# EasyEDA Pro project pcb.epro, board PCB1
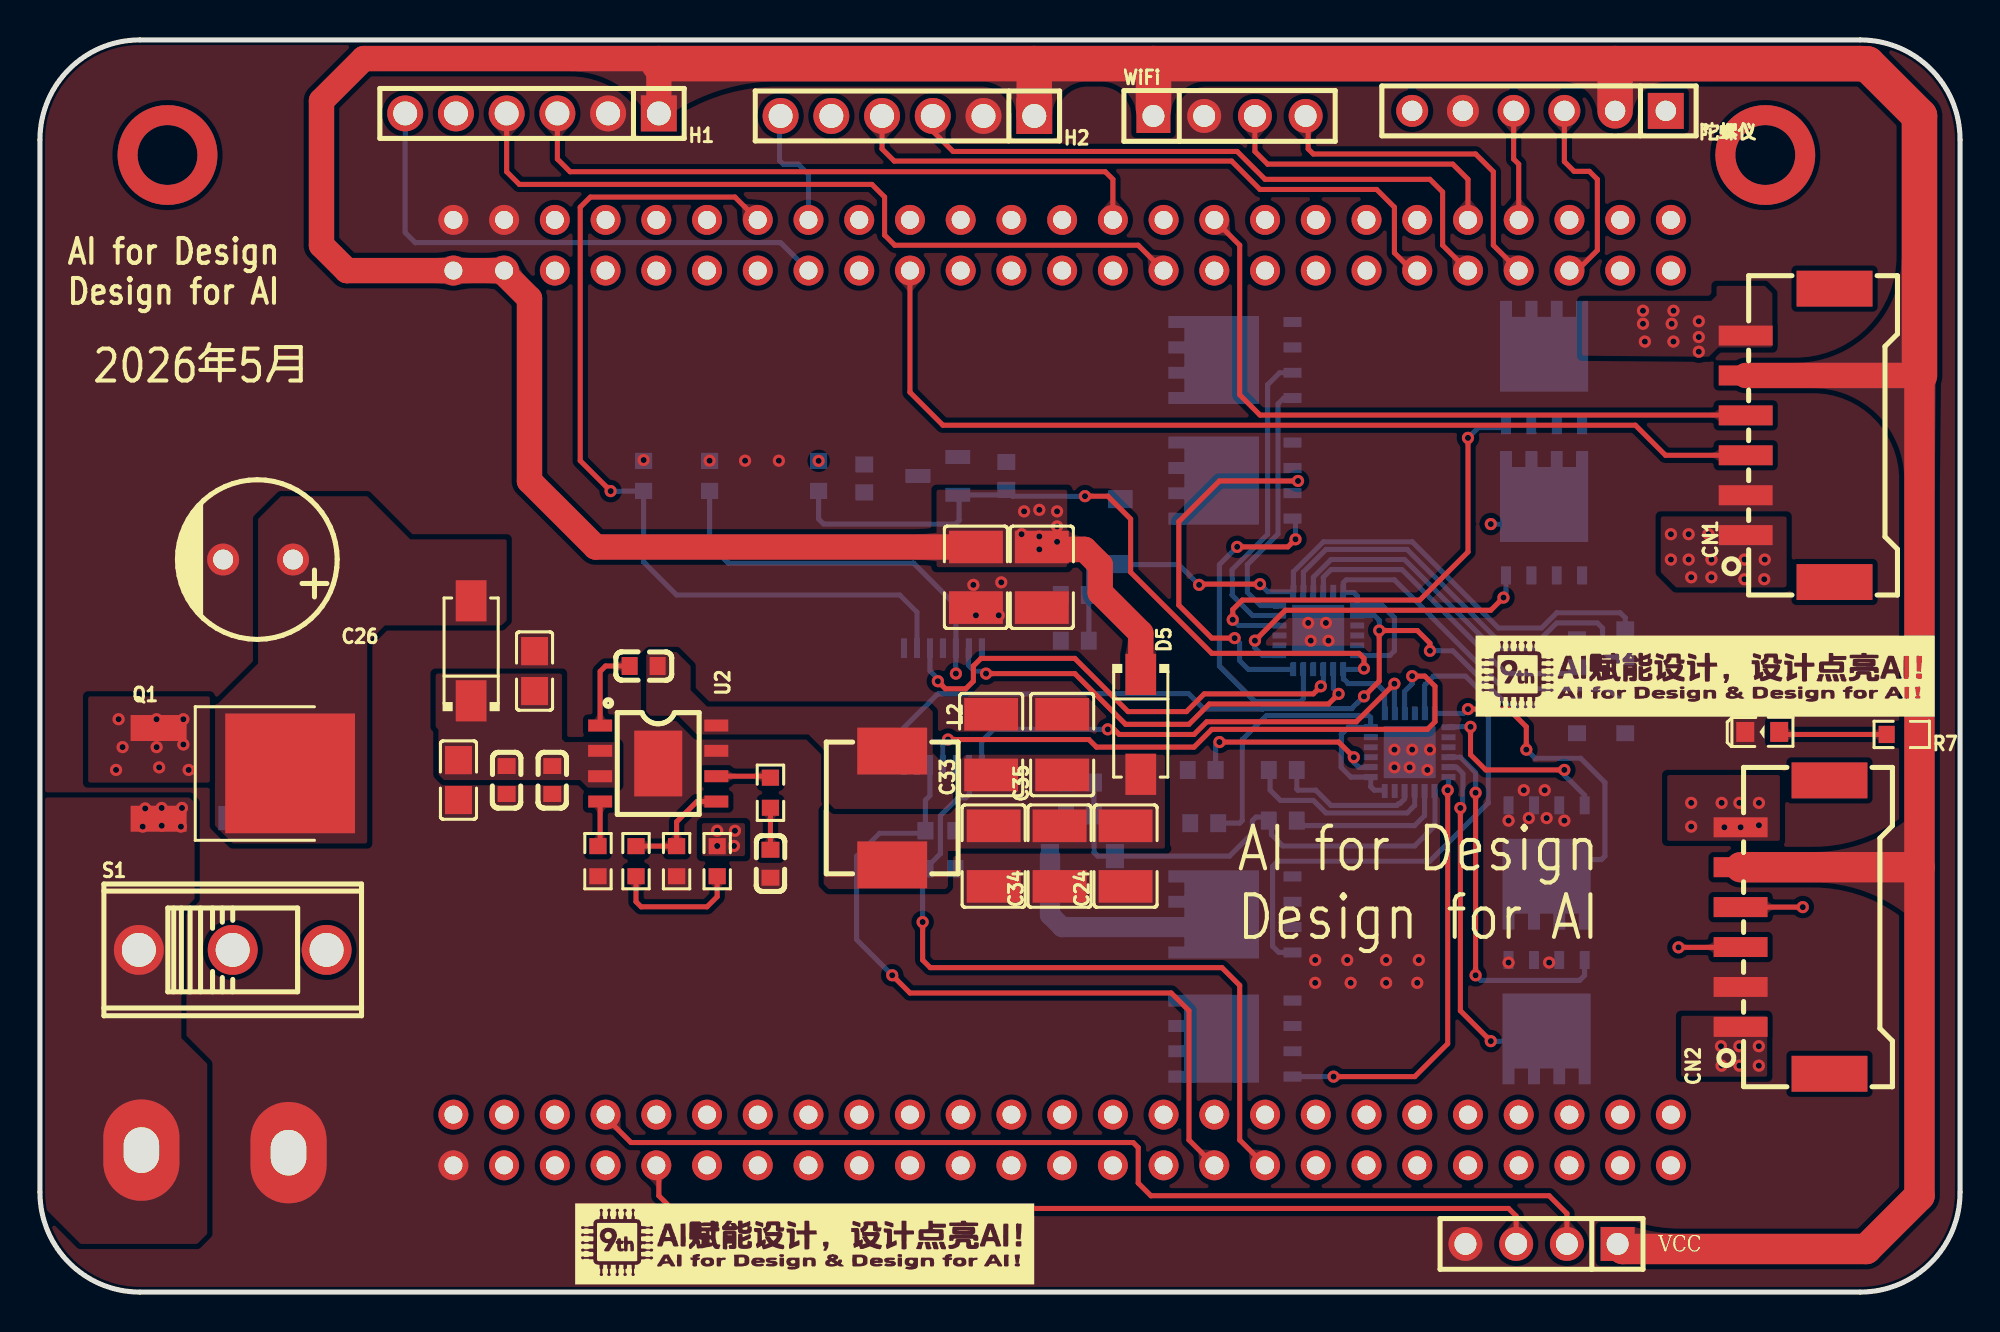
[diagram p1: board, top side]
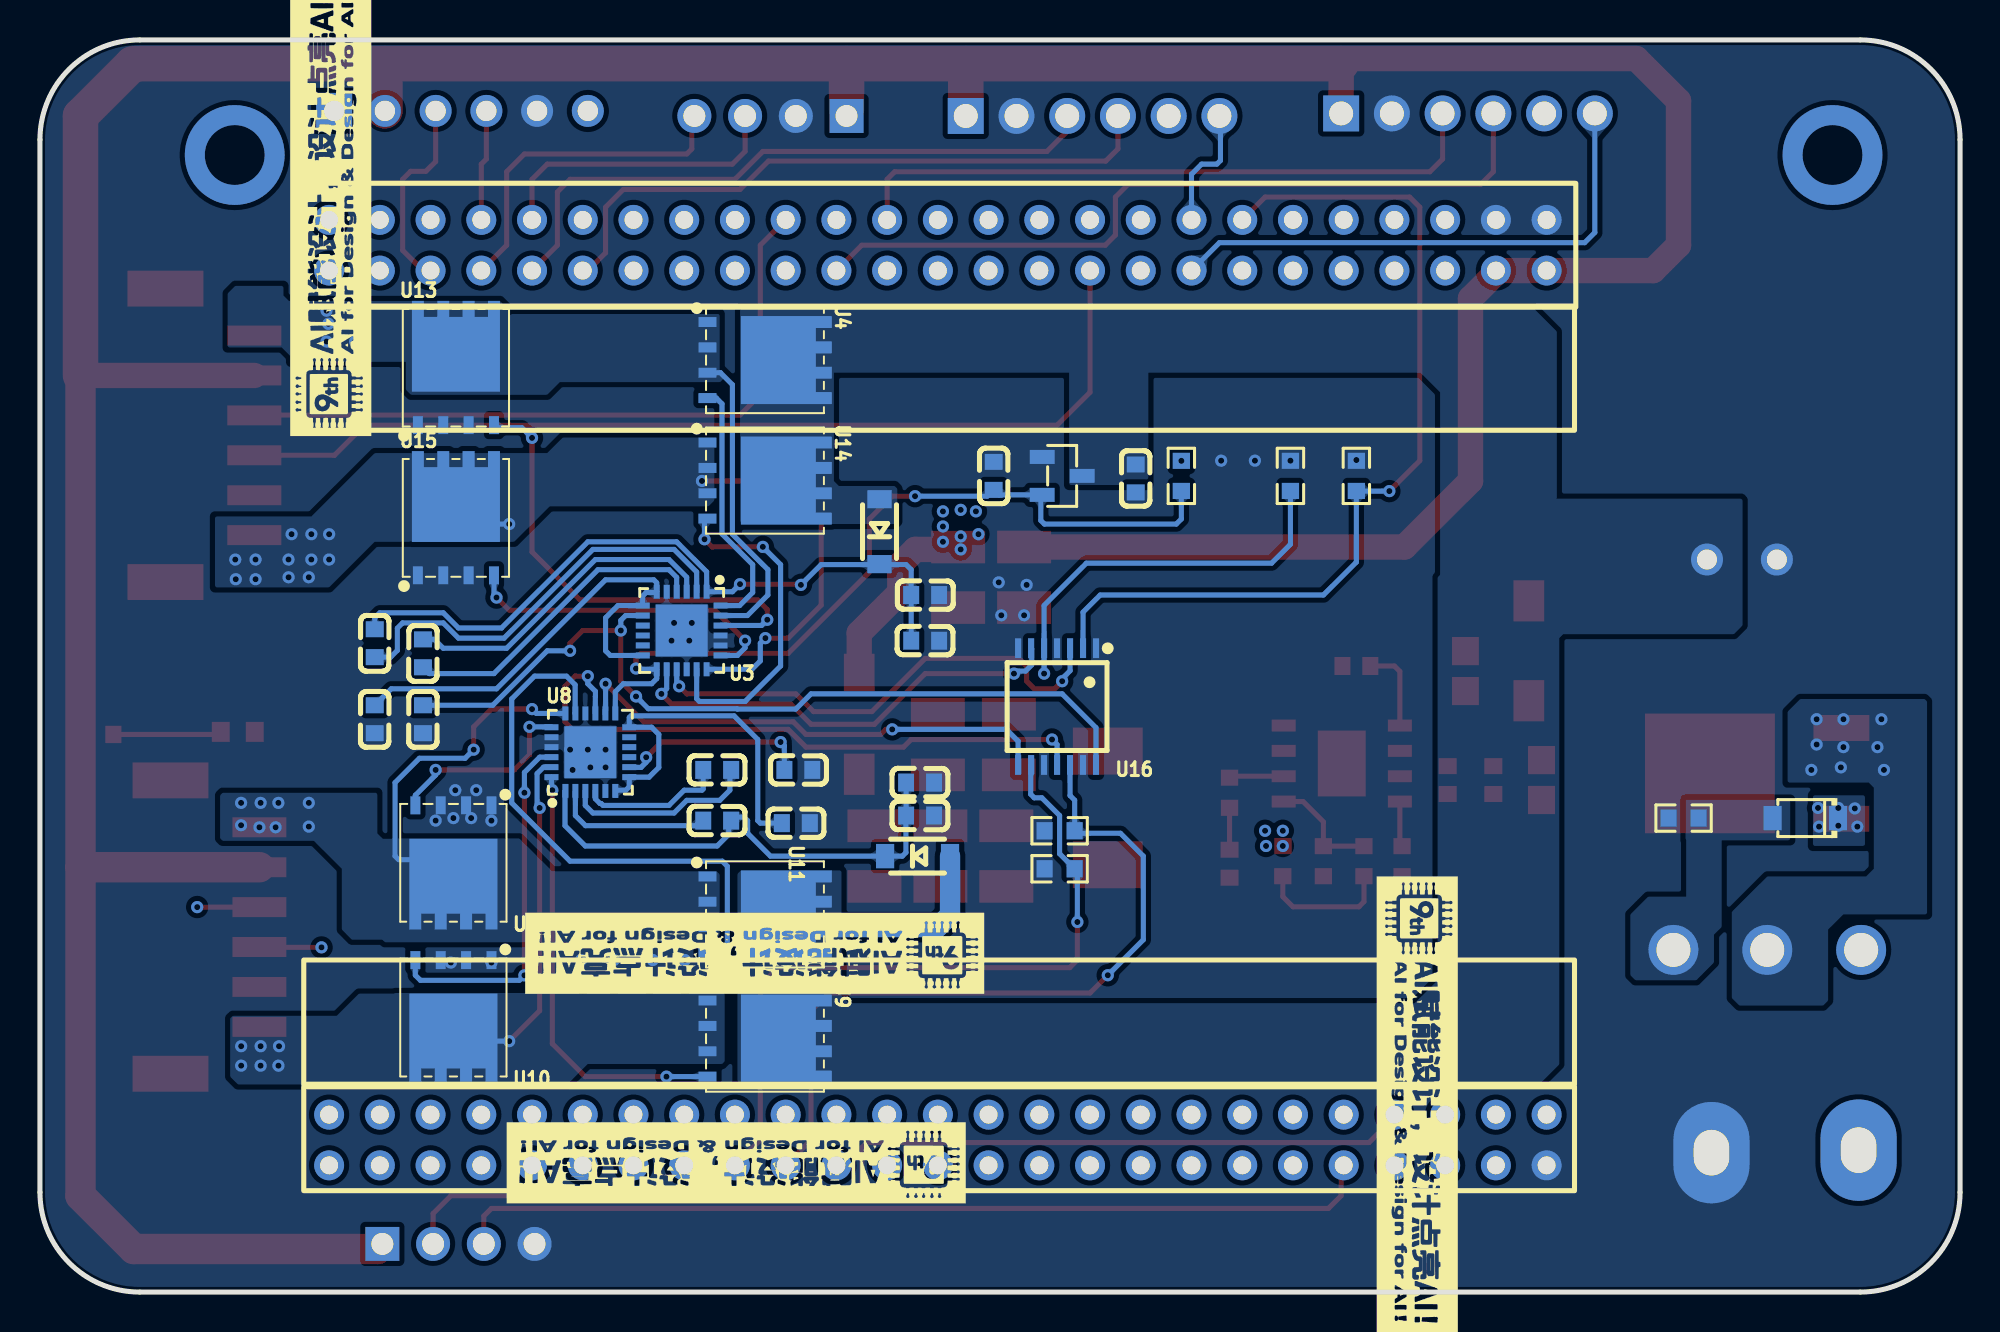
[diagram p2: board, bottom side, seen from below]

Outline 96.14 x 62.74 mm; copper layers: Top Layer, Inner1, Inner2, Bottom Layer. Coordinates in mm from the lower left corner of the outline.
Outline path: 0,57.74 0,5 arc(1.46,1.46) 5,0 91.14,0 arc(94.67,1.46) 96.14,5 96.14,57.74 arc(94.67,61.27) 91.14,62.74 5,62.74 arc(1.46,61.27) 0,57.74
Stack: Top Layer 0.035mm Outer layer thickness 1oz / Dielectric1 0.2104mm 7628 RC49% 8.6mil / Inner1 0.0152mm Inner layer thickness / Dielectric2 1.065mm 1.1mm H/HOZ Copper / Inner2 0.0152mm Inner layer thickness / Dielectric3 0.2104mm 7628 RC49% 8.6mil / Bottom Layer 0.035mm Outer layer thickness 1oz

## Design rules (mm)
spacing copperThickness1oz (default): track to track 0.102, other pairs 0.152 to 0.3
spacing copperThickness2oz: track to track 0.203, other pairs 0.152 to 0.3
spacing Plane_innerPlane: track to track 0.102, other pairs 0.152 to 0.3
spacing Copper_copperRegion: track to track 0.102, other pairs 0.152 to 0.3
spacing Copper_copperRegion_copperThickness1oz: track to track 0.102, other pairs 0.152 to 0.3
spacing Copper_copperRegion_Copper_copperRegion: track to track 0.102, other pairs 0.152 to 0.3
track width copperThickness1oz (default): min 0.127, default 0.254, max 2.54
track width copperThickness2oz: min 0.203, default 0.254, max 2.54
differential pair differentialPair (default): width min 0.127, default 0.254, max 2.54; gap min 0.152, default 0.152
net VCCBAT uses copperRegion_copperThickness1oz
net GND uses copperRegion_copperThickness1oz
net VCC5V uses copperRegion_copperThickness1oz
net $2N36 uses copperRegion_copperThickness1oz
net $2N34 uses copperRegion_copperThickness1oz
net $2N35 uses copperRegion_copperThickness1oz
net L_A uses copperRegion_copperThickness1oz
net L_B uses copperRegion_copperThickness1oz
net R_A uses copperRegion_copperThickness1oz
net R_B uses copperRegion_copperThickness1oz
net $2N77 uses copperRegion_copperThickness1oz
net $2N70 uses copperRegion_copperThickness1oz
net $2N78 uses copperRegion_copperThickness1oz
pour e1000 uses Copper_copperRegion, copperRegion_Copper_copperRegion
pour e1002 uses Copper_copperRegion, copperRegion_Copper_copperRegion
pour e1004 uses Copper_copperRegion, copperRegion_Copper_copperRegion
pour e1006 uses Copper_copperRegion, copperRegion_Copper_copperRegion
pour e1008 uses Copper_copperRegion, copperRegion_Copper_copperRegion
pour e1010 uses Copper_copperRegion, copperRegion_Copper_copperRegion
pour e1012 uses Copper_copperRegion, copperRegion_Copper_copperRegion
pour e1014 uses Copper_copperRegion, copperRegion_Copper_copperRegion
pour e1016 uses Copper_copperRegion, copperRegion_Copper_copperRegion
pour e1018 uses Copper_copperRegion, copperRegion_Copper_copperRegion
pour e1020 uses Copper_copperRegion, copperRegion_Copper_copperRegion
pour e1022 uses Copper_copperRegion, copperRegion_Copper_copperRegion
pour e1024 uses Copper_copperRegion, copperRegion_Copper_copperRegion
pour e1026 uses Copper_copperRegion, copperRegion_Copper_copperRegion
pour e1028 uses Copper_copperRegion, copperRegion_Copper_copperRegion
pour e1030 uses Copper_copperRegion, copperRegion_Copper_copperRegion
pour e1032 uses Copper_copperRegion, copperRegion_Copper_copperRegion
pour e1034 uses Copper_copperRegion, copperRegion_Copper_copperRegion
pour e1036 uses Copper_copperRegion, copperRegion_Copper_copperRegion
pour e1038 uses Copper_copperRegion, copperRegion_Copper_copperRegion
pour e1040 uses Copper_copperRegion, copperRegion_Copper_copperRegion
pour e1042 uses Copper_copperRegion, copperRegion_Copper_copperRegion
pour e1044 uses Copper_copperRegion, copperRegion_Copper_copperRegion
pour e1046 uses Copper_copperRegion, copperRegion_Copper_copperRegion
pour e1048 uses Copper_copperRegion, copperRegion_Copper_copperRegion
pour e1050 uses Copper_copperRegion, copperRegion_Copper_copperRegion
pour e1052 uses Copper_copperRegion, copperRegion_Copper_copperRegion
pour e1054 uses Copper_copperRegion, copperRegion_Copper_copperRegion
pour e1056 uses Copper_copperRegion, copperRegion_Copper_copperRegion
pour e1058 uses Copper_copperRegion, copperRegion_Copper_copperRegion
pour e1063 uses Copper_copperRegion, copperRegion_Copper_copperRegion
pour e1065 uses Copper_copperRegion, copperRegion_Copper_copperRegion
pour e1067 uses Copper_copperRegion, copperRegion_Copper_copperRegion

## Placement (name value [footprint] x y rotation side)
5V  15-21VGC/TR8  [LED0603_GREEN]  86.23 28.07 180 top
C1  1uF  [C1210]  50.17 35.81 270 top
C2  10uF  [C1210]  46.86 35.81 270 top
C3  4.7uF  [C0805]  20.95 25.65 90 top
C4  1uF  [C0603]  79.38 32.51 90 bottom
C5  10uF  [C0603]  51.82 32.64 180 bottom
C6  100nF  [C0603]  51.82 34.93 0 bottom
C7  1uF  [C0603]  58.17 26.16 0 bottom
C8  4.7uF  [C0805]  24.77 31.12 270 top
C12  100nF  [C0603]  52.07 25.53 180 bottom
C13  1uF  [C0603]  76.96 28.7 90 bottom
C14  1uF  [C0603]  79.38 28.7 90 bottom
C15  100nF  [C0603]  76.96 32 90 bottom
C16  1uF  [C0603]  58.29 23.5 0 bottom
C17  100nF  [C0603]  62.23 26.16 180 bottom
C18  1uF  [C0603]  62.23 23.62 180 bottom
C19  10uF  [C0603]  52.07 23.88 180 bottom
C23  47uF  [C1210]  51.18 27.43 90 top
C24  47uF  [C1210]  54.36 21.84 90 top
C25  100nF  [C0603]  30.23 31.37 180 top
C26  470uF  [CAP-TH_BD8.0-P3.50-D0.6-FD_1]  10.92 36.7 180 top
C30  4.7uF  [C0603]  23.37 25.65 90 top
C31  4.7nF  [C0603]  36.58 21.46 270 top
C32  100nF  [C0603]  25.65 25.65 90 top
C33  47uF  [C1210]  47.63 27.43 90 top
C34  47uF  [C1210]  51.05 21.84 90 top
C35  47uF  [C1210]  47.75 21.84 270 top
C36  1uF  [C0603]  41.27 40.77 90 bottom
C37  1uF  [C0603]  48.39 40.89 270 bottom
CN1  5024940670  [CONN-SMD_5024940670]  87.63 42.93 90 top
CN2  5024940670  [CONN-SMD_5024940670]  87.38 18.29 90 top
D3  1N5819W  [SOD-123_L2.7-W1.6-LS3.7-R-RD]  54.1 38.1 90 bottom
D4  1N5819W  [SOD-123_L2.7-W1.6-LS3.7-R-RD]  52.2 21.84 180 bottom
D5  SS54  [SMA_L4.4-W2.8-LS5.4-R-RD]  55.12 28.45 270 top
D6  SS54  [SMA_L4.4-W2.8-LS5.4-R-RD]  21.59 32.13 90 top
D8  BZT52C16  [SOD-123_L2.7-W1.6-LS3.7-RD]  7.75 23.75 0 bottom
H1  2.54-1x6P直针  [HDR-TH_6P-P2.54-V-M-1]  24.64 59.06 180 top
H2  2.54-1x6P直针  [HDR-TH_6P-P2.54-V-M-1]  43.43 58.93 180 top
L2  4.7uH  [IND-SMD_L7.2-W6.6_GPSR07X0]  42.67 24.26 270 top
NOREF  -  [Pad_e1076]  12.45 6.99 270 top
NOREF#2  -  [Pad_e1075]  5.08 7.11 270 top
Q1  HY19P03D  [TO-252-2_L6.6-W6.1-P4.57-LS9.9-TL-CW]  9.23 25.99 0 top
R7  4.7kΩ  [R0603]  93.22 27.94 180 top
R8  10kΩ  [R0603]  30.23 40.89 90 bottom
R9  10kΩ  [R0603]  33.53 40.89 90 bottom
R10  10kΩ  [R0603]  45.08 23.11 180 bottom
R11  10kΩ  [R0603]  45.08 21.21 180 bottom
R12  200kΩ  [R0603]  27.94 21.59 90 top
R13  51kΩ  [R0603]  33.91 21.59 270 top
R14  1.5kΩ  [R0603]  29.85 21.59 90 top
R15  10kΩ  [R0603]  31.88 21.59 270 top
R16  20kΩ  [R0603]  36.58 25.02 270 top
R18  10kΩ  [R0603]  13.84 23.75 180 bottom
R20  2.2kΩ  [R0603]  38.99 40.89 270 bottom
S1  K3-1391D-5MM  [SW-TH_K3-1391D-5MM]  9.65 17.15 0 top
U1  DRV8701ERGET  [STM32F407ZGT6—正点原子最小系统板【旧版】]  50.42 28.19 90 bottom
U2  SCT2450STER  [ESOP-8_L4.9-W3.9-P1.27-LS6.0-BL-EP]  30.96 26.48 270 top
U3  DRV8701ERGET  [VQFN-24_L4.0-W4.0-P0.50-BL-EP2.5]  64.01 33.15 0 bottom
U4  TPH1R403NL  [TDSON-8_L5.9-W5.2-P1.27-BL]  60.94 46.7 270 bottom
U6  HT33  [SOT-23-3_L2.9-W1.3-P1.90-LS2.4-BL-1]  44.96 40.89 270 bottom
U8  DRV8701ERGET  [VQFN-24_L4.0-W4.0-P0.50-BL-EP2.5]  68.58 27.05 180 bottom
U9  TPH1R403NL  [TDSON-8_L5.9-W5.2-P1.27-BL]  60.94 12.7 270 bottom
U10  TPH1R403NL  [TDSON-8_L5.9-W5.2-P1.27-BL]  75.44 14.86 0 bottom
U11  TPH1R403NL  [TDSON-8_L5.9-W5.2-P1.27-BL]  60.94 18.92 270 bottom
U12  TPH1R403NL  [TDSON-8_L5.9-W5.2-P1.27-BL]  75.44 22.61 0 bottom
U13  TPH1R403NL  [TDSON-8_L5.9-W5.2-P1.27-BL]  75.31 45.21 180 bottom
U14  TPH1R403NL  [TDSON-8_L5.9-W5.2-P1.27-BL]  60.94 40.66 270 bottom
U15  TPH1R403NL  [TDSON-8_L5.9-W5.2-P1.27-BL]  75.31 37.69 180 bottom
U16  SN74HC125PWR  [TSSOP-14_L5.0-W4.4-P0.65-LS6.5-BL]  45.21 29.34 0 bottom
WiFi  wifi  [HDR-TH_4P-P2.54-V-F]  59.56 58.93 0 top
超声波PD7PE9  超声波  [HDR-TH_4P-P2.54-V-M]  75.18 2.41 180 top
陀螺仪  PM254V-11-06-H85  [HDR-TH_6P-P2.54-V-F]  75.06 59.18 180 top

## Footprints (pads in the part's own frame, mm; a bottom-side part is the same pattern mirrored in y, then rotated)
C0603
  rect 0.8x0.9 smd: 1(-0.7,0) 2(0.7,0)
C0805
  rect 1.41x1.35 smd: 1(-1,0) 2(1,0)
C1210
  rect 1.635x2.7 smd: 1(-1.518,0) 2(1.518,0)
CAP-TH_BD8.0-P3.50-D0.6-FD_1
  round 1.6 hole 1: 1(-1.75,0) 2(1.75,0)
CONN-SMD_5024940670
  rect 1x2.7 smd: 1(-5,2.225) 2(-3,2.225) 3(-1,2.225) 4(1,2.225) 5(3,2.225) 6(5,2.225)
  rect 1.8x3.8 smd: 7(-7.35,-2.225) 8(7.35,-2.225)
ESOP-8_L4.9-W3.9-P1.27-LS6.0-BL-EP
  rect 0.6x1.2 smd: 1(-1.905,-2.909) 2(-0.635,-2.909) 3(0.635,-2.909) 4(1.905,-2.909) 5(1.905,2.909) 6(0.635,2.909) 7(-0.635,2.909) 8(-1.905,2.909)
  rect 3.3x2.4 smd: 9(0,0)
HDR-TH_4P-P2.54-V-F
  rect 1.7x1.7 hole 1.1: 1(-3.81,0)
  round 1.7 hole 1.1: 2(-1.27,0) 3(1.27,0) 4(3.81,0)
HDR-TH_4P-P2.54-V-M
  rect 1.7x1.7 hole 1.1: 1(-3.81,0)
  round 1.7 hole 1.1: 2(-1.27,0) 3(1.27,0) 4(3.81,0)
HDR-TH_6P-P2.54-V-F
  rect 1.8x1.8 hole 1.02: 1(-6.35,0)
  round 1.6 hole 1.02: 2(-3.81,0) 3(-1.27,0) 4(1.27,0) 5(3.81,0) 6(6.35,0)
HDR-TH_6P-P2.54-V-M-1
  rect 1.8x1.8 hole 1.2: 1(-6.35,0)
  round 1.8 hole 1.2: 2(-3.81,0) 3(-1.27,0) 4(1.27,0) 5(3.81,0) 6(6.35,0)
IND-SMD_L7.2-W6.6_GPSR07X0
  rect 2.35x3.5 smd: 1(-2.85,0) 2(2.85,0)
LED0603_GREEN
  rect 0.9x1 smd: 1(-0.85,0) 2(0.85,0)
Pad_e1075
  oval 5.08x3.81 hole 2.286x1.778: 1(0,0)
Pad_e1076
  oval 5.08x3.81 hole 2.286x1.778: 1(0,0)
R0603
  rect 0.806x0.864 smd: 1(-0.753,0) 2(0.753,0)
SMA_L4.4-W2.8-LS5.4-R-RD
  rect 2.062x1.539 smd: 1(2.503,0) 2(-2.503,0)
SOD-123_L2.7-W1.6-LS3.7-R-RD
  rect 0.909x1.219 smd: 1(1.625,0) 2(-1.625,0)
SOD-123_L2.7-W1.6-LS3.7-RD
  rect 0.91x1.22 smd: 1(-1.635,0) 2(1.635,0)
SOT-23-3_L2.9-W1.3-P1.90-LS2.4-BL-1
  rect 0.7x1.25 smd: 1(-0.95,-1) 2(0.95,-1) 3(0,1)
STM32F407ZGT6—正点原子最小系统板【旧版】
  round 1.5 hole 0.9: 1(-21.844,31.242) 2(-21.844,28.702) 3(-21.844,26.162) 4(-21.844,23.622) 5(-21.844,21.082) 6(-21.844,18.542) 7(-21.844,16.002) 8(-21.844,13.462) 9(-21.844,10.922) 10(-21.844,8.382) 11(-21.844,5.842) 12(-21.844,3.302) 13(-21.844,0.762) 14(-21.844,-1.778) 15(-21.844,-4.318) 16(-21.844,-6.858) 17(-21.844,-9.398) 18(-21.844,-11.938) 19(-21.844,-14.478) 20(-21.844,-17.018) 21(-21.844,-19.558) 22(-21.844,-22.098) 23(-21.844,-24.638) 24(-21.844,-27.178) 25(-21.844,-29.718) 26(-19.304,31.242) 27(-19.304,28.702) 28(-19.304,26.162) 29(-19.304,23.622) 30(-19.304,21.082) 31(-19.304,18.542) 32(-19.304,16.002) 33(-19.304,13.462) 34(-19.304,10.922) 35(-19.304,8.382) 36(-19.304,5.842) 37(-19.304,3.302) 38(-19.304,0.762) 39(-19.304,-1.778) 40(-19.304,-4.318) 41(-19.304,-6.858) 42(-19.304,-9.398) 43(-19.304,-11.938) 44(-19.304,-14.478) 45(-19.304,-17.018) 46(-19.304,-19.558) 47(-19.304,-22.098) 48(-19.304,-24.638) 49(-19.304,-27.178) 50(-19.304,-29.718) 51(25.527,31.242) 52(25.527,28.702) 53(25.527,26.162) 54(25.527,23.622) 55(25.527,21.082) 56(25.527,18.542) 57(25.527,16.002) 58(25.527,13.462) 59(25.527,10.922) 60(25.527,8.382) 61(25.527,5.842) 62(25.527,3.302) 63(25.527,0.762) 64(25.527,-1.778) 65(25.527,-4.318) 66(25.527,-6.858) 67(25.527,-9.398) 68(25.527,-11.938) 69(25.527,-14.478) 70(25.527,-17.018) 71(25.527,-19.558) 72(25.527,-22.098) 73(25.527,-24.638) 74(25.527,-27.178) 75(25.527,-29.718) 76(22.987,31.242) 77(22.987,28.702) 78(22.987,26.162) 79(22.987,23.622) 80(22.987,21.082) 81(22.987,18.542) 82(22.987,16.002) 83(22.987,13.462) 84(22.987,10.922) 85(22.987,8.382) 86(22.987,5.842) 87(22.987,3.302) 88(22.987,0.762) 89(22.987,-1.778) 90(22.987,-4.318) 91(22.987,-6.858) 92(22.987,-9.398) 93(22.987,-11.938) 94(22.987,-14.478) 95(22.987,-17.018) 96(22.987,-19.558) 97(22.987,-22.098) 98(22.987,-24.638) 99(22.987,-27.178) 100(22.987,-29.718)
SW-TH_K3-1391D-5MM
  round 2.5 hole 1.7: 1(-4.7,0) 2(0,0) 3(4.7,0)
TDSON-8_L5.9-W5.2-P1.27-BL
  rect 0.5x0.9 smd: 1(-1.905,-1.775) 2(-0.635,-1.775) 3(0.635,-1.775) 4(1.905,-1.775)
  custom 4.41x4.55 smd: 5(0,1.775)
TO-252-2_L6.6-W6.1-P4.57-LS9.9-TL-CW
  rect 2.8x1.3 smd: 1(-3.292,2.273) 3(-3.292,-2.273)
  rect 6.5x6 smd: 2(3.292,0)
TSSOP-14_L5.0-W4.4-P0.65-LS6.5-BL
  rect 0.305x0.991 smd: 1(-1.95,-2.925) 2(-1.3,-2.925) 3(-0.65,-2.925) 4(0,-2.925) 5(0.65,-2.925) 6(1.3,-2.925) 7(1.95,-2.925) 8(1.95,2.925) 9(1.3,2.925) 10(0.65,2.925) 11(0,2.925) 12(-0.65,2.925) 13(-1.3,2.925) 14(-1.95,2.925)
VQFN-24_L4.0-W4.0-P0.50-BL-EP2.5
  rect 0.3x0.7 smd: 1(-1.25,-1.942) 2(-0.75,-1.942) 3(-0.25,-1.942) 4(0.25,-1.942) 5(0.75,-1.942) 6(1.25,-1.942) 13(1.25,1.942) 14(0.75,1.942) 15(0.25,1.942) 16(-0.25,1.942) 17(-0.75,1.942) 18(-1.25,1.942)
  rect 0.7x0.3 smd: 7(1.948,-1.25) 8(1.948,-0.75) 9(1.948,-0.25) 10(1.948,0.25) 11(1.948,0.75) 12(1.948,1.25) 19(-1.948,1.25) 20(-1.948,0.75) 21(-1.948,0.25) 22(-1.948,-0.25) 23(-1.948,-0.75) 24(-1.948,-1.25)
  rect 2.6x2.6 smd: 25(0.001,-0.001)

## Nets
DVDD: C13.2 U3.8 U16.14
GND: 5V.2 C1.2 C2.2 C3.1 C5.2 C6.1 C7.1 C8.1 C12.2 C13.1 C14.1 C16.1 C19.2 C23.2 C24.1 C26.2 C30.1 C31.2 C32.1 C33.2 C34.1 C35.2 C36.1 C37.1 CN1.2 CN2.2 H1.2 H2.2 NOREF.1 R8.2 R9.2 R10.1 R11.1 R12.1 R15.2 R18.1 U1.25 U1.74 U1.75 U2.7 U2.9 U3.5 U3.16 U3.20 U3.21 U3.25 U6.1 U8.5 U8.16 U8.20 U8.21 U8.25 U10.1 U10.2 U10.3 U12.1 U12.2 U12.3 U13.1 U13.2 U13.3 U15.1 U15.2 U15.3 U16.1 U16.4 U16.7 U16.10 U16.13 WiFi.2 超声波PD7PE9.4 陀螺仪.5
VBAT: U1.98
VCC5V: C1.1 C2.1 CN1.5 CN2.5 D5.2 H1.1 H2.1 R7.1 R13.1 U1.99 U1.100 WiFi.1 超声波PD7PE9.1 陀螺仪.2
VCCBAT: C26.1 C36.2 D3.1 D4.1 D6.1 Q1.2 U4.5 U6.3 U9.5 U11.5 U14.5
K1: U1.3
K2: U1.28
K3: U1.4
K4: U1.15
K5: U1.40
L_A: CN1.6 U3.23 U4.1 U4.2 U4.3 U13.5
L_B: CN1.1 U3.18 U14.1 U14.2 U14.3 U15.5
L_EN: U3.14 U16.6
L_EN_IN: R9.1 U1.33 U16.5
L_PH: U3.15 U16.3
L_PH_IN: R8.1 U1.69 U16.2
NET3: U1.24
NET49: U1.48
NSLEEP: C37.2 R20.2 U3.13 U6.2 U8.13
PA1: U1.23
PA2: U1.47 超声波PD7PE9.2
PA3: U1.21 超声波PD7PE9.3
PA4: U1.45
PA5: U1.20
PA6: U1.84
PA7: U1.44
PA8: H2.3 U1.80
PA11: U1.83
PA12: U1.59
PA15: U1.87
PB0: U1.18
PB1: U1.42
PB2: U1.17
PB3: U1.61
PB4: CN2.4 U1.73
PB5: CN2.3 U1.85
PB6: CN1.4 U1.60
PB7: CN1.3 U1.91
PB10: H1.3 U1.62
PB11: H1.4 U1.86
PB12: U1.39
PB13: U1.14
PB15: U1.1
PC0: H1.6 U1.93
PC1: H2.6 U1.68
PC2: U1.46
PC3: U1.22
PC4: U1.19
PC5: U1.43
PC6: U1.51
PC7: U1.76
PC8: U1.56
PC9: H2.4 U1.81
PC10: U1.78 陀螺仪.3
PC11: U1.54 陀螺仪.4
PC12: U1.55 WiFi.3
PD0: U1.63
PD1: U1.88
PD2: U1.79 WiFi.4
PD3: U1.64
PD4: U1.89
PD5: U1.65
PD6: U1.52
PD7: U1.77
PD8: U1.30
PD9: U1.5
PD10: U1.29
PD11: U1.13
PD12: U1.37
PD13: U1.12
PD14: U1.6
PD15: U1.7
PE0: U1.67
PE1: U1.92
PE2: U1.70
PE3: U1.95
PE5: U1.94
PE7: U1.32
PE8: U1.8
PE10: U1.35
PE11: U1.11
PE13: U1.34
PE15: U1.31
PF0: U1.2
PF1: U1.27
PF5: U1.38
PF8: U1.16
PF11: U1.41
PF12: U1.26
PF13: U1.36
PG6: U1.57
PG7: U1.82
PG8: U1.58
PG9: U1.90
PG10: U1.66
PG11: U1.71
PG12: U1.96
PG13: U1.72
PG14: U1.97
PG15: U1.53
R_A: CN2.1 U8.23 U9.1 U9.2 U9.3 U10.5
R_B: CN2.6 U8.18 U11.1 U11.2 U11.3 U12.5
R_EN: U8.14 U16.8
R_EN_IN: R11.2 U1.9 U16.9
R_PH: U8.15 U16.11
R_PH_IN: R10.2 U1.10 U16.12
$2N34: D8.1 NOREF#2.1 Q1.3 S1.1
$2N35: Q1.1 S1.2
$2N36: D8.2 R18.2 S1.3
$2N66: R13.2 R14.1
$2N67: R14.2 R15.1 U2.5
$2N69: R16.1 U2.6
$2N70: C25.1 L2.1 U2.8
$2N71: R12.2 U2.4
$2N72: C25.2 U2.1
$2N73: C31.1 R16.2
$2N74: 5V.1 R7.2
$2N77: C23.1 C24.2 C33.1 C34.2 C35.1 D5.1 L2.2
$2N78: C3.2 C8.2 C30.2 C32.2 D6.2 U2.2 U2.3
$3N3: U8.17 U11.4
$3N4: U8.19 U12.4
$3N5: U8.22 U10.4
$3N6: U8.24 U9.4
$3N14: C12.1 C18.2 C19.1 D4.2 U8.1
$3N16: C18.1 U8.2
$3N17: C17.1 U8.4
$3N18: C17.2 U8.3
$3N20: C16.2 U8.6 U8.7 U8.12
$3N21: C7.2 U8.8
$3N22: U3.17 U14.4
$3N23: U3.19 U15.4
$3N24: U3.22 U13.4
$3N25: U3.24 U4.4
$3N35: C4.2 C5.1 C6.2 D3.2 U3.1
$3N37: C4.1 U3.2
$3N38: C15.1 U3.4
$3N39: C15.2 U3.3
$3N41: C14.2 U3.6 U3.7 U3.12
$3N62: R20.1

Pads without a net: CN1 7 8; CN2 7 8; H1 5; H2 5; U1 49 50; U3 9 10 11; U8 9 10 11; 陀螺仪 1 6

## Via types
v1: diameter 5, hole 3, Top Layer to Bottom Layer, 2 vias
v2: diameter 0.61, hole 0.305, Top Layer to Bottom Layer, 139 vias

## Routing (per net, layer and track width the routed paths; a pad name or vN(x,y) marks a point on that pad's centre or on a via; arc(x,y) is an arc through that point)
DVDD: length 43.2
  Top Layer w0.254: v2(66.29,29.85) 67.06,30.61 v2(67.06,33.15) 68.96,33.15 69.6,32.51 v2(69.6,32.13)
  Bottom Layer w0.254: U3.8 66.81,33.9 67.06,33.66 v2(67.06,33.15) ; C13.2 73.47,29.4 70.74,32.13 v2(69.6,32.13) ; v2(66.29,29.85) 65.68,29.23 61.24,29.23 61.22,29.21 58.29,29.21 57.53,29.97 44.96,29.97 43.26,28.28 U16.14
GND:
  vias: v2(30.23,41.69) v2(33.53,41.66) v2(35.31,41.66) v2(37,41.66) v2(46.74,35.43) v2(46.86,33.91) v2(48.01,33.91) v2(48.13,35.56) v2(63.5,33.53) v2(63.63,32.64) v2(63.85,16.64) v2(63.85,15.49) v2(64.39,33.53) v2(64.52,32.64) v2(65.46,16.64) v2(65.63,15.49) v2(67.4,16.64) v2(67.4,15.49) v2(67.82,27.18) v2(67.82,26.29) v2(68.58,26.29) v2(68.71,27.18) v2(68.96,15.49) v2(69.04,16.64) v2(69.47,26.16) v2(69.6,27.18) v2(73.53,23.62) v2(73.53,16.51) v2(74.3,25.15) v2(74.55,23.75) v2(75.34,25.15) v2(75.44,23.75) v2(75.57,16.51) v2(76.33,23.62)
VCC5V: length 272.7
  Top Layer w1.27: C2.1 27.82,37.33 24.51,40.64 24.51,49.78 23.11,51.18 ; 23.11,51.18 U1.99 ; 23.11,51.18 U1.100 15.37,51.18 14.1,52.45 14.1,59.69 16.21,61.8 30.99,61.8 H1.1 ; D5.2 55.12,33.02 53.09,35.05 53.09,36.43 52.31,37.21 v2(50.04,37.21) ; CN1.5 94.11,45.93
  Top Layer w1.524: 94.11,21.29 CN2.5 ; 94.11,21.29 94.11,45.93 ; 94.11,21.29 94.11,4.83 91.44,2.16 79.25,2.16 超声波PD7PE9.1
  Top Layer w1.778: 30.99,61.55 49.76,61.55 ; 49.76,61.55 55.75,61.55 ; 49.76,61.55 49.78,61.53 H2.1 ; 55.75,61.55 78.87,61.55 ; 55.75,61.55 55.75,59.31 ; 78.87,61.55 91.14,61.55 arc(91.32,61.55) 91.5,61.53 94.11,58.93 94.11,45.93 ; 78.87,61.55 陀螺仪.2
  Inner1 w1.27: v2(50.04,39.19) v2(50.04,37.86) v2(50.04,37.21) ; 50.04,36.7 50.04,24.51 47.88,22.35 v2(34.75,22.35) v2(33.91,22.35)
  vias: v2(33.91,23.11) v2(34.8,23.11) v2(49.15,37.97) v2(49.28,39.12) v2(50.93,39.12) v2(50.93,38.36) v2(50.93,37.59)
VCCBAT: length 12.1
  Bottom Layer w1.016: 59.17,18.92 58.53,18.29 51.18,18.29 50.57,18.9 D4.1
(no net):
  vias: v1(6.39,56.97) v1(86.39,56.97)
L_A: length 15.6
  Bottom Layer w0.254: U3.23 60.72,33.9 59.69,34.93 59.69,36.2 61.47,37.97 61.47,45.47 62.07,46.06 U4.3
  vias: v2(80.26,49.17) v2(80.26,48.51) v2(80.36,47.63) v2(81.79,49.17) v2(81.7,48.51) v2(81.79,47.63) v2(83.06,48.64) v2(83.06,47.85) v2(83.06,47.12)
L_B: length 21.7
  Top Layer w0.254: v2(59.82,32.77) 58.67,32.77 57.02,34.42 57.02,38.61 59.05,40.64 v2(62.99,40.64)
  Bottom Layer w0.254: v2(72.64,38.48) 74.33,38.48 U15.5 ; v2(59.82,32.77) 60.07,32.51 60.07,31.62 60.49,31.21 U3.18
  vias: v2(81.66,37.97) v2(81.66,36.7) v2(82.55,37.97) v2(82.55,36.7) v2(82.68,35.81) v2(83.54,37.97) v2(83.69,36.7) v2(83.69,35.81) v2(85.34,36.7) v2(85.34,35.72) v2(86.36,36.7) v2(86.33,35.72)
L_EN: length 22.6
  Top Layer w0.254: v2(47.37,30.99) 51.82,30.99 54.36,28.45 57.53,28.45 58.55,29.46 64.52,29.46 v2(65.02,29.97)
  Bottom Layer w0.254: v2(65.02,29.97) 64.76,30.24 U3.14 ; U16.6 46.48,32.23 46.48,31.42 46.79,31.12 47.24,31.12 v2(47.37,30.99)
L_EN_IN: length 57.9
  Inner2 w0.254: v2(45.86,30.99) 46.12,30.73 46.12,11.92 47.24,10.8 61.98,10.8 U1.33
  Bottom Layer w0.254: v2(45.86,30.99) U16.5 45.86,34.4 43.74,36.52 34.47,36.52 33.53,37.47 R9.1
L_PH: length 24.8
  Top Layer w0.254: v2(44.96,30.61) 45.34,30.23 46.36,30.23 46.74,30.61 46.74,31.37 47.12,31.75 51.82,31.75 54.48,29.08 57.4,29.08 58.29,29.97 63.75,29.97 v2(64.14,30.35)
  Bottom Layer w0.254: U3.15 64.26,30.48 v2(64.14,30.35) ; v2(44.96,30.61) 44.96,30.73 44.56,31.13 U16.3
L_PH_IN: length 46.2
  Top Layer w0.254: v2(28.58,40.13) 27.05,41.66 27.05,54.36 27.56,54.86 34.8,54.86 U1.69
  Bottom Layer w0.254: U16.2 43.91,34.07 43.05,34.93 31.88,34.93 30.23,36.58 R8.1 30.22,40.13 v2(28.58,40.13)
NSLEEP: length 40.9
  Top Layer w0.254: v2(52.32,39.88) 53.47,39.88 54.61,38.74 54.61,36.07 58.67,32 66.04,32 66.29,31.75 v2(66.29,31.24)
  Bottom Layer w0.254: R20.2 38.99,38.74 39.24,38.48 45.85,38.48 46.03,38.66 46.03,39.88 U6.2 48.14,39.94 C37.2 48.7,39.88 v2(52.32,39.88) ; v2(66.29,31.24) 66.26,31.21 U3.13 65.26,30.73 65.51,30.48 66.93,30.48 67.33,30.08 U8.13
PA2: length 52.8
  Top Layer w0.254: 超声波PD7PE9.2 76.45,3.94 75.57,4.83 55.63,4.83 54.99,5.46 54.99,7.24 54.74,7.49 29.59,7.49 28.32,8.76 U1.47
PA3: length 46.3
  Top Layer w0.254: 超声波PD7PE9.3 73.91,3.81 73.53,4.19 31.62,4.19 30.99,4.83 30.99,6.22 U1.21
PA8: length 32
  Top Layer w0.254: U1.80 70.23,52.45 70.23,55.12 69.6,55.75 61.34,55.75 59.94,57.15 45.72,57.15 44.7,58.17 H2.3
PB4: length 101.1
  Top Layer w0.254: CN2.4 v2(88.27,19.29)
  Inner2 w0.254: v2(88.27,19.29) 88.76,19.29 89.41,19.94 89.41,49.28 83.57,55.12 26.16,55.12 25.78,54.74 U1.73
PB5: length 61
  Top Layer w0.254: CN2.3 85.14,17.27 v2(82.04,17.27)
  Inner2 w0.254: U1.85 57.15,49.53 57.15,19.94 59.82,17.27 v2(82.04,17.27)
PB6: length 35.1
  Top Layer w0.254: U1.60 60.07,52.45 60.07,44.96 61.09,43.94 85.39,43.94 CN1.4
PB7: length 49.2
  Top Layer w0.254: CN1.3 81.39,41.93 79.88,43.43 45.21,43.43 43.56,45.09 U1.91
PB10: length 32.6
  Top Layer w0.254: U1.62 53.72,55.75 53.34,56.13 26.54,56.13 25.91,56.77 H1.3
PB11: length 39
  Top Layer w0.254: U1.86 54.99,52.45 42.8,52.45 42.29,52.96 42.29,54.86 41.66,55.5 24,55.5 23.37,56.13 H1.4
PC0: length 27
  Bottom Layer w0.254: H1.6 18.29,53.09 18.8,52.58 37.08,52.58 U1.93
PC1: length 6.3
  Bottom Layer w0.254: H2.6 37.03,58.88 37.03,56.69 37.21,56.52 37.97,56.52 38.48,56.01 U1.68
PC9: length 32.3
  Top Layer w0.254: U1.81 68.71,51.18 67.82,52.07 67.82,54.36 66.93,55.25 61.09,55.25 59.67,56.67 42.77,56.67 42.16,57.28 H2.4
PC10: length 9.9
  Top Layer w0.254: 陀螺仪.3 76.33,56.64 76.82,56.15 77.58,56.15 77.98,55.75 77.98,52.2 76.96,51.18 U1.78
PC11: length 5.6
  Top Layer w0.254: 陀螺仪.4 73.79,56.77 74.04,56.52 U1.54
PC12: length 15.1
  Top Layer w0.254: U1.55 71.5,55.75 70.74,56.52 61.47,56.52 60.83,57.15 WiFi.3
PD2: length 16.9
  Top Layer w0.254: WiFi.4 63.5,58.8 63.5,57.28 63.75,57.02 71.88,57.02 72.77,56.13 72.77,52.45 U1.79
R_A: length 17.9
  Top Layer w0.254: v2(71.12,24.26) 71.12,14.1 v2(72.64,12.57)
  Bottom Layer w0.254: U8.23 70.92,26.3 71.25,25.98 71.25,24.38 v2(71.12,24.26) ; U10.5 74.93,12.57 v2(72.64,12.57)
  vias: v2(84.17,12.32) v2(84.2,11.34) v2(85.09,12.32) v2(85.09,11.34) v2(86.06,12.32) v2(86.06,11.34)
R_B: length 17.8
  Top Layer w0.254: v2(74.42,27.18) 74.42,28.32 73.53,29.21 v2(71.5,29.21)
  Bottom Layer w0.254: U12.5 76.26,21.66 78.18,21.66 78.36,21.84 78.36,25.53 77.14,26.75 74.85,26.75 v2(74.42,27.18) ; v2(71.5,29.21) 71.28,28.99 U8.18
  vias: v2(82.68,24.51) v2(82.68,23.32) v2(84.2,24.51) v2(84.34,23.29) v2(85.09,24.51) v2(85.15,23.29) v2(86.07,24.51) v2(86.07,23.39)
R_EN: length 24.7
  Top Layer w0.254: v2(67.82,30.48) 65.91,28.58 58.42,28.58 57.79,27.94 54.04,27.94 53.78,28.19 v2(53.47,28.19)
  Bottom Layer w0.254: U16.8 47.16,27.6 47.75,28.19 v2(53.47,28.19) ; v2(67.82,30.48) 67.82,29.15 67.83,29.14 U8.14
R_EN_IN: length 36.9
  Top Layer w0.254: U1.9 60.07,7.62 60.07,15.37 59.18,16.26 44.58,16.26 44.2,16.64 v2(44.2,18.54)
  Bottom Layer w0.254: v2(44.2,18.54) 44.2,21.07 R11.2 45.08,21.96 45.08,23.88 45.97,24.77 46.36,24.77 46.53,24.94 46.53,26.39 U16.9
R_PH: length 31.6
  Top Layer w0.254: v2(45.47,27.69) 52.52,27.69 52.9,27.31 57.79,27.31 58.67,28.19 69.47,28.19 69.85,28.58 69.85,30.35 69.34,30.86 v2(68.71,30.86)
  Bottom Layer w0.254: U8.15 68.33,29.84 68.33,29.85 68.33,30.1 68.71,30.48 v2(68.71,30.86) ; v2(45.47,27.69) 45.21,27.43 U16.11
R_PH_IN: length 37.9
  Top Layer w0.254: v2(42.67,15.88) 43.56,14.99 56.64,14.99 57.53,14.1 57.53,7.62 U1.10
  Bottom Layer w0.254: U16.12 44.56,24.88 44.33,24.65 R10.2 44.2,22.99 42.04,22.99 40.89,21.84 40.89,17.65 v2(42.67,15.88)
$2N34:
  vias: v2(5.14,23.32) v2(5.27,24.23) v2(6.1,24.26) v2(6.1,23.37) v2(7.06,23.32) v2(7.11,24.26)
$2N35:
  vias: v2(3.81,26.16) v2(3.94,28.7) v2(4.14,27.31) v2(5.84,28.7) v2(5.84,27.31) v2(5.97,26.29) v2(7.18,28.7) v2(7.18,27.44) v2(7.45,26.16)
$2N66: length 6.7
  Top Layer w0.254: R14.1 29.85,19.56 30.1,19.3 33.4,19.3 33.91,19.81 R13.2
$2N67: length 5.7
  Top Layer w0.254: 33.86,24.58 32.89,24.58 31.88,23.56 R15.1 R14.2
$2N69: length 2.7
  Top Layer w0.254: 33.86,25.85 36.5,25.85 R16.1
$2N71: length 2.3
  Top Layer w0.254: U2.4 28.05,22.45 R12.2
$2N72: length 4.3
  Top Layer w0.254: C25.2 28.32,31.37 28.05,31.1 U2.1
$2N73: length 2.1
  Top Layer w0.254: R16.2 C31.1
$2N74: length 5.4
  Top Layer w0.254: R7.2 87.21,27.94 5V.1
$3N3: length 27.7
  Bottom Layer w0.254: U11.4 62.03,17.02 61.72,17.32 61.72,21.34 61.98,21.59 69.6,21.59 72.52,24.51 72.52,29.72 71.37,30.86 69.78,30.86 69.34,30.43 69.34,29.01 U8.17
$3N4: length 9.7
  Top Layer w0.254: v2(71.63,28.32) 71.63,26.92 72.39,26.16 v2(76.33,26.16)
  Bottom Layer w0.254: v2(76.33,26.16) 76.33,25.91 77.34,24.89 U12.4 ; U8.19 70.55,28.32 v2(71.63,28.32)
$3N5: length 18.3
  Top Layer w0.254: v2(71.88,15.87) v2(71.88,25.02)
  Bottom Layer w0.254: U8.22 71.12,26.8 71.88,26.04 v2(71.88,25.02) ; U10.4 77.34,15.88 77.09,15.62 72.13,15.62 v2(71.88,15.87)
$3N6: length 21.8
  Top Layer w0.254: v2(70.48,25.15) 70.48,12.45 68.83,10.8 v2(64.77,10.8)
  Bottom Layer w0.254: v2(64.77,10.8) U9.4 ; v2(70.48,25.15) 70.53,25.19 U8.24
$3N14: length 24.9
  Bottom Layer w0.254: U8.1 69.85,25.09 69.85,23.37 68.83,22.35 62.23,22.35 61.66,22.93 61.66,23.62 ; C12.1 C19.1 52.78,23.87 52.78,22.02 52.96,21.84 D4.2 59.56,21.84 60.71,22.99 60.71,23.62 60.89,23.8 61.35,23.8 C18.2
$3N16: length 7.8
  Bottom Layer w0.254: U8.2 69.33,23.88 68.82,23.37 63.31,23.37 63.06,23.62
$3N17: length 7.2
  Bottom Layer w0.254: U8.4 68.33,24.71 68.1,24.48 68.04,24.48 67.95,24.38 64.64,24.38 63.88,25.15 62.99,25.15 62.93,25.21 C17.1
$3N18: length 9.6
  Bottom Layer w0.254: U8.3 68.83,25.11 68.83,24.38 68.45,24 64.39,24 63.75,24.64 62.1,24.64 61.6,25.15 61.6,26.1 C17.2
$3N20: length 19
  Bottom Layer w0.254: U8.6 67.29,25.15 66.81,25.15 66.63,25.32 U8.7 65.64,25.8 65.15,26.29 65.15,27.94 65.51,28.3 U8.12 66.63,28.79 66.55,28.87 61.38,28.87 60.2,27.69 60.2,23.62 60.07,23.5 C16.2
$3N21: length 9.7
  Top Layer w0.254: v2(65.79,26.8) 65.02,27.56 v2(59.05,27.56)
  Bottom Layer w0.254: v2(65.79,26.8) 65.79,26.54 66.04,26.29 66.62,26.29 U8.8 ; v2(59.05,27.56) 58.87,27.37 C7.2
$3N22: length 17
  Top Layer w0.254: v2(59.94,37.34) 62.48,37.34 v2(62.86,37.72)
  Bottom Layer w0.254: U14.4 62.86,38.61 v2(62.86,37.72) ; U3.17 63.26,29.73 63.12,29.59 60.83,29.59 59.05,31.37 59.05,36.45 v2(59.94,37.34)
$3N23: length 16.3
  Top Layer w0.254: v2(73.28,34.8) 72.64,34.16 62.36,34.16 v2(60.83,32.64)
  Bottom Layer w0.254: U3.19 61.21,31.9 60.83,32.28 v2(60.83,32.64) ; v2(73.28,34.8) 73.41,34.93 U15.4
$3N24: length 23.8
  Top Layer w0.254: v2(59.72,33.69) 59.72,34.19 60.2,34.67 69.09,34.67 71.5,37.08 v2(71.5,42.8)
  Bottom Layer w0.254: v2(59.72,33.69) 60.01,33.4 62.06,33.4 U3.22 ; v2(71.5,42.8) 72.01,43.31 73.28,43.31 U13.4
$3N25: length 12.8
  Bottom Layer w0.254: U4.4 62.28,44.79 61.99,44.51 61.99,37.99 60.45,36.45 60.45,35.05 61.11,34.4 U3.24
$3N35: length 35.5
  Top Layer w0.254: v2(61.09,35.47) 58.08,35.47 v2(58.04,35.43)
  Bottom Layer w0.254: v2(61.09,35.47) 61.47,35.09 62.76,35.09 62.76,36.09 64.26,37.59 68.71,37.59 73.02,33.27 75.18,33.27 75.95,34.04 79.12,34.04 79.38,33.78 C4.2 ; C5.1 C6.2 52.52,36.2 52.77,36.45 57.02,36.45 v2(58.04,35.43)
$3N37: length 21.1
  Bottom Layer w0.254: 63.26,35.09 63.26,36.08 64.39,37.21 68.45,37.21 72.9,32.77 75.18,32.77 75.95,33.53 77.98,33.53 78.24,33.26 78.24,32.15 78.58,31.81 C4.1
$3N38: length 15.9
  Bottom Layer w0.254: 64.26,35.09 64.26,35.81 64.64,36.2 68.2,36.2 73.41,30.99 76.65,30.99 C15.1
$3N39: length 16.3
  Bottom Layer w0.254: C15.2 76.39,32.7 75.95,32.26 72.77,32.26 68.33,36.7 64.64,36.7 63.76,35.82 63.76,35.09
$3N41: length 24.2
  Bottom Layer w0.254: U3.12 67.58,31.9 67.82,32.13 67.82,33.78 67.2,34.4 U3.7 65.97,34.41 65.97,34.87 65.79,35.05 65.3,35.05 65.26,35.09 65.26,35.54 65.41,35.69 67.82,35.69 73.28,30.23 78.55,30.23 C14.2
$3N62:
  vias: v2(38.99,41.65)

## Copper pours and planes (outline as drawn; the poured copper is in the pictures)
GND on Top Layer: -9.65,67.31 105.16,67.31 105.16,-4.32 -9.65,-4.32
GND on Bottom Layer: -17.78,75.57 103.25,75.57 103.25,-6.98 -17.78,-6.98
GND on Inner1: -11.94,71.63 110.11,71.63 110.11,-6.22 -11.94,-6.22
GND on Inner2: -13.97,73.15 112.01,73.15 112.01,-6.98 -13.97,-6.98
VCC5V on Top Layer: 44.89,40.2 51.44,40.2 51.44,36.32 44.89,36.32
VCC5V on Top Layer: 33.15,23.5 35.31,23.5 35.31,21.84 33.15,21.84
VCC5V on Inner1: 48.7,40.2 51.44,40.2 51.44,36.32 48.7,36.32
VCC5V on Inner1: 33.15,23.37 35.43,23.37 35.43,21.84 33.15,21.84
VCCBAT on Top Layer: 10.92,31.5 10.92,38.74 12.06,39.88 16.38,39.88 18.54,37.72 23.37,37.72 23.37,33.66 23.11,33.4 17.27,33.4 16.38,32.51 16.38,22.48 9.65,22.48 8.76,23.37 8.76,29.48 8.9,29.48
VCCBAT on Bottom Layer: 40.64,46.86 44.61,46.86 44.61,40.44 40.64,40.44
VCCBAT on Bottom Layer: 10.88,39.68 10.96,39.75 22.23,39.75 26.16,35.81 26.16,15.62 27.31,14.48 55.63,14.48 56.01,14.86 56.01,21.08 56.05,21.13 61.04,21.13 61.21,20.96 61.21,10.51 20.95,10.51 20.07,11.4 20.07,32.77 19.87,32.97 11.32,32.97 10.88,33.4
VCCBAT on Bottom Layer: 20.19,39.75 20.19,48.13 21.34,49.28 61.09,49.28 61.09,38.61 60.96,38.48 53.34,38.48 53.21,38.61 53.21,40.26 53.34,40.39 56.13,40.39 56.39,40.64 56.39,46.06 27.01,46.06 26.04,45.09 26.04,35.69 24.26,35.69
L_A on Top Layer: 77.22,49.66 83.68,49.66 83.95,49.93 83.95,50.42 86.36,50.42 86.74,50.04 86.74,47.33 84.03,47.33 83.57,46.86 77.22,46.91
L_A on Bottom Layer: 77.22,49.66 83.68,49.66 83.95,49.93 83.95,50.42 86.36,50.42 86.74,50.04 86.74,47.33 84.03,47.33 83.57,46.86 83.57,46.61 76.45,46.61 77.22,47.37
L_A on Bottom Layer: 62.1,49.01 72.53,49.01 72.64,48.9 72.64,49.2 73.11,49.66 77.43,49.66 77.82,49.27 77.82,45.21 77.57,44.96 70.74,44.96 70.1,45.59 62.08,45.59 61.84,45.84 62.1,46.1
L_B on Top Layer: 87.46,38.86 87.46,35.39 87.38,35.31 81.92,35.31 81.15,36.07 81.15,38.86
L_B on Bottom Layer: 77.47,42.04 79.38,42.04 82.55,38.86 87.38,38.86 87.38,35.31 81.66,35.31 79.38,37.59 77.6,37.59 77.47,37.72
L_B on Bottom Layer: 62.25,42.82 69.96,42.82 70.74,42.04 77.47,42.04 77.6,41.91 77.6,37.59 72.39,37.59 70.61,39.37 62.67,39.37 62.25,39.79
R_A on Top Layer: 82.17,13.84 86.49,13.84 86.49,10.8 82.17,10.8
R_A on Bottom Layer: 61.85,14.99 78.36,14.99 78.61,14.73 78.61,10.54 78.49,10.41 69.72,10.41 68.71,11.43 61.98,11.43 61.85,11.56
R_A on Bottom Layer: 77.64,14.96 80.16,14.96 81.28,13.84 86.49,13.84 86.61,13.72 86.61,10.8 86.22,10.4 78.31,10.4 78.31,14.3
R_B on Top Layer: 81.48,25.91 87.12,25.91 87.12,22.61 81.48,22.61
R_B on Bottom Layer: 62.1,17.91 62.1,20.93 62.26,21.08 70.49,21.08 72.14,22.73 78.23,22.73 79.12,21.84 79.12,17.78 78.87,17.53 62.48,17.53
R_B on Bottom Layer: 77.99,22.71 78.97,22.71 79.25,22.99 79.25,25.02 87,25.02 87.12,24.89 87.12,22.73 87,22.61 82.42,22.61 81.03,21.21 81.03,18.16 80.52,17.65 78.85,17.65 78.85,21.85
$2N34 on Top Layer: 0,24.78 7.49,24.78 7.75,24.52 7.75,19.7 7.08,19.04 7.08,12.73 8.38,11.43 8.38,2.92 7.87,2.41 2.03,2.41 -1.02,5.46 -1.02,24.26 -0.76,24.51 -0.27,24.51
$2N34 on Bottom Layer: 4.76,24.89 7.37,24.89 7.37,22.35 4.76,22.35
$2N35 on Top Layer: 2.41,29.85 8.51,29.85 8.51,25.53 2.41,25.53
$2N35 on Bottom Layer: 1.78,29.72 8,29.72 8.64,29.08 8.64,25.53 4.57,25.53 4.32,25.27 4.32,21.21 4.7,20.83 9.65,20.83 11.43,19.05 11.43,14.73 11.05,14.35 6.86,14.35 6.6,14.61 6.6,18.16 5.84,18.92 1.65,18.92 1.65,29.59
$2N36 on Bottom Layer: 8.51,24.68 13.74,24.68 13.74,22.64 8.51,22.64
$2N36 on Bottom Layer: 11.94,24.64 13.27,23.3 13.72,23.3 13.72,19.81 15.62,19.81 16.51,18.92 16.51,15.88 16.26,15.62 13.21,15.62 12.32,16.51 12.32,17.91 11.94,18.29
$2N70 on Top Layer: 30.52,32.07 31.87,32.07 32.58,31.37 32.58,30.16 33.4,29.34 44.45,29.34 44.7,29.08 44.7,27.01 45.11,26.61 45.72,26.61 45.72,24.51 45.42,24.21 39.78,24.21 39.37,24.62 39.37,27.05 38.48,27.94 32.89,27.94 31.96,28.88 30.56,28.88 30.35,29.08 30.35,31.9
$2N77 on Top Layer: 39.37,24.26 46.1,24.26 46.1,26.67 46.36,26.92 56.33,26.92 56.33,22.29 56.39,22.23 45.97,22.23 45.85,22.1 45.47,22.1 45.47,20.32 45.34,20.19 39.5,20.19 39.24,20.45 39.24,24.13
$2N78 on Top Layer: 19.81,30.99 26.14,30.99 26.14,27.71 26.29,27.56 28.83,27.56 28.96,27.43 28.96,25.4 28.83,25.27 27.43,25.27 27.05,25.65 20.23,25.65 19.95,25.93 19.95,28.18 19.81,28.32

Small or netless copper shapes (teardrops, artwork), in the pictures only: 102 on Top Layer, 140 on Bottom Layer, 6 on Inner2

## Text on the board
Top Silkscreen Layer: AI for Design / Design for AI | VCC | 2026年5月
